# EAGLE design Adafruit Bluefruit LE nRF8001 v2 (EAGLE 6.4)
AUTHOR: K. Townsend
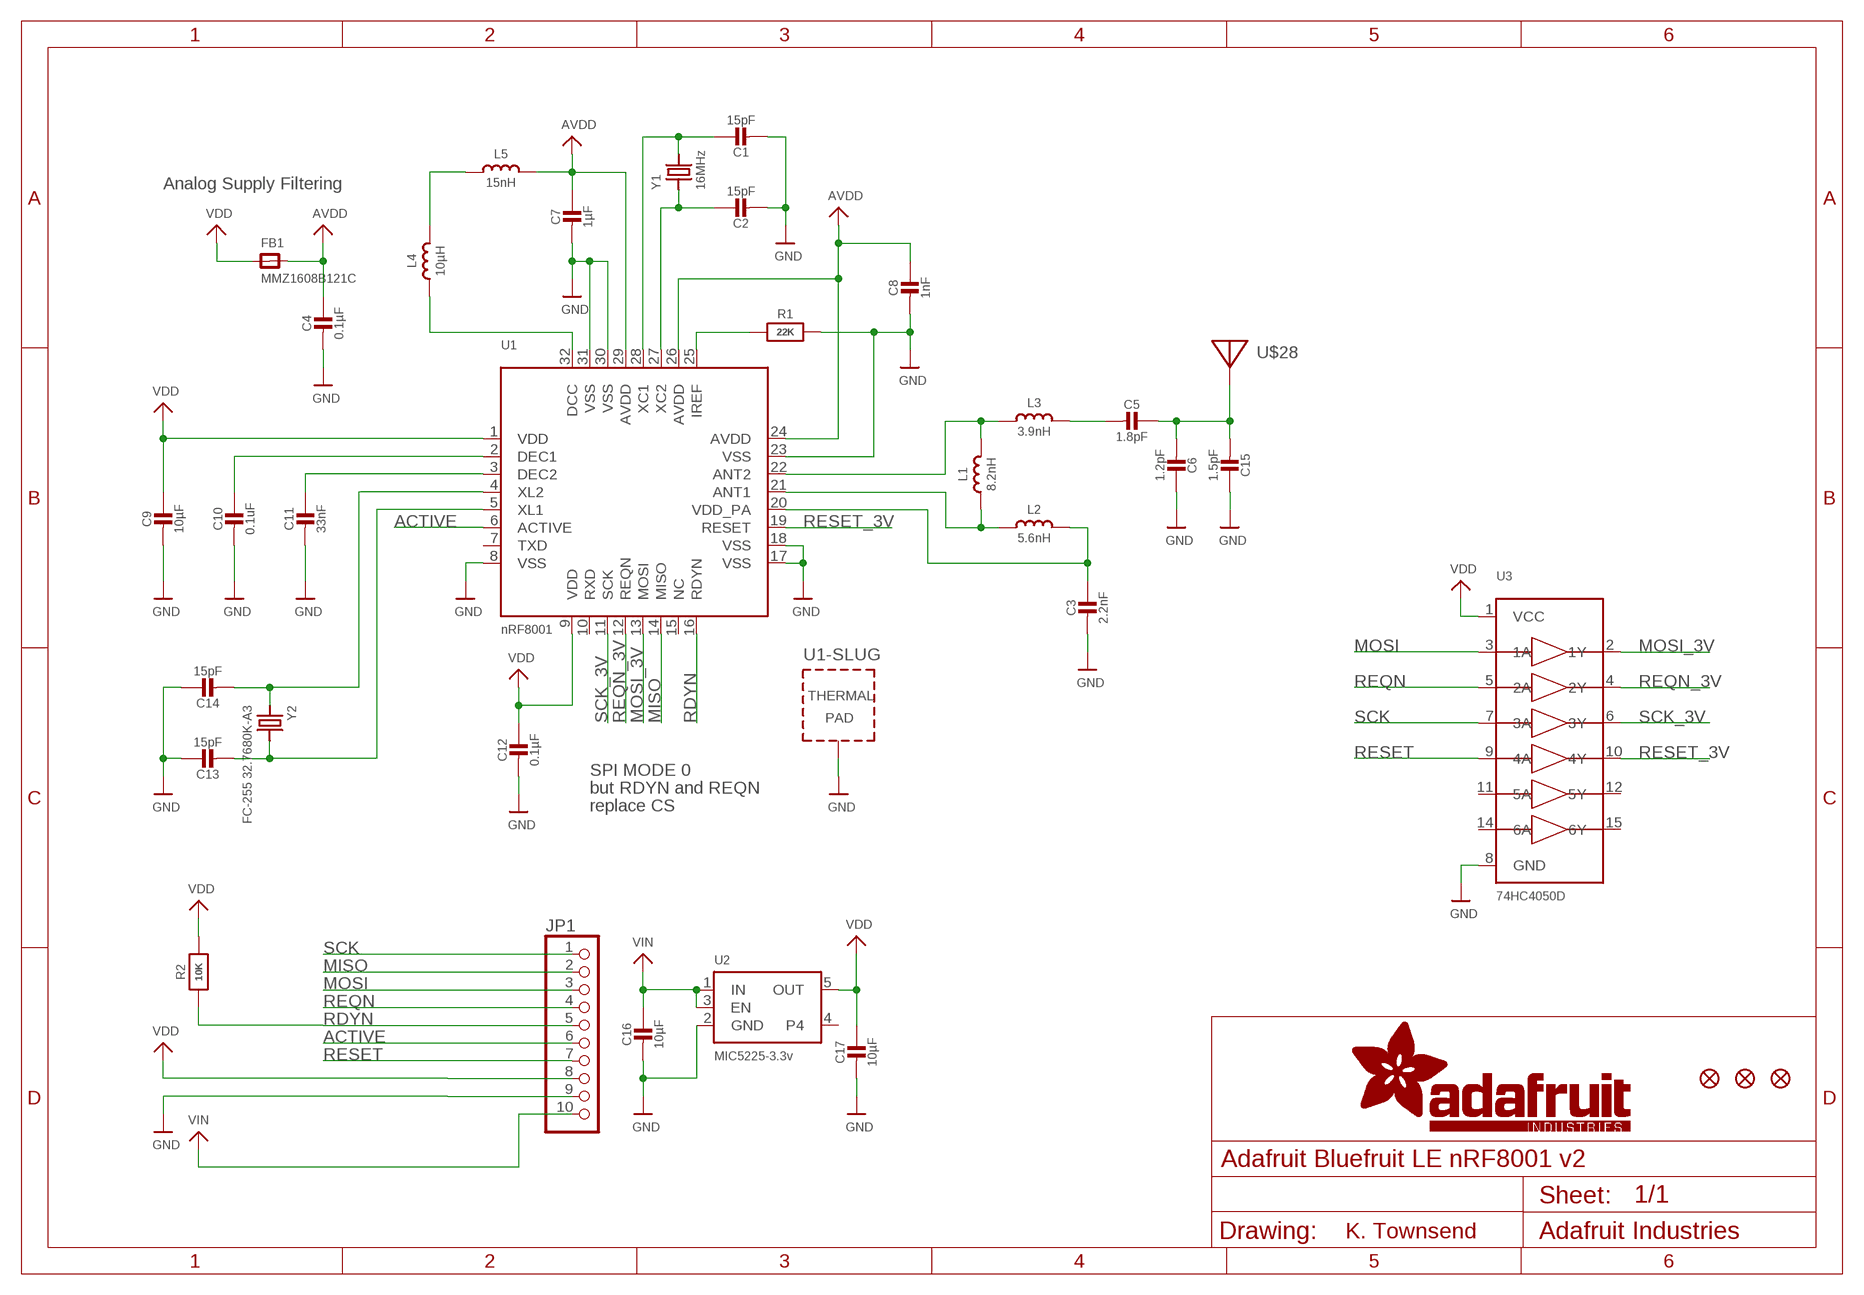
[diagram p0: schematic, sheet 1]

## Parts
C1  15pF  CAP_CERAMIC0805-NOOUTLINE  [0805-NO]
C2  15pF  CAP_CERAMIC0805-NOOUTLINE  [0805-NO]
C3  2.2nF  CAP_CERAMIC_0402  [_0402]
C4  0.1µF  CAP_CERAMIC0805-NOOUTLINE  [0805-NO]
C5  1.8pF  CAP_CERAMIC_0402MP  [_0402MP]
C6  1.2pF  CAP_CERAMIC_0402MP  [_0402MP]
C7  1µF  CAP_CERAMIC0805-NOOUTLINE  [0805-NO]
C8  1nF  CAP_CERAMIC_0603  [_0603]
C9  10µF  CAP_CERAMIC0805-NOOUTLINE  [0805-NO]
C10  0.1uF  CAP_CERAMIC0805-NOOUTLINE  [0805-NO]
C11  33nF  CAP_CERAMIC0805-NOOUTLINE  [0805-NO]
C12  0.1µF  CAP_CERAMIC0805-NOOUTLINE  [0805-NO]
C13  15pF  CAP_CERAMIC0805-NOOUTLINE  [0805-NO]
C14  15pF  CAP_CERAMIC0805-NOOUTLINE  [0805-NO]
C15  1.5pF  CAP_CERAMIC_0402MP  [_0402MP]
C16  10µF  CAP_CERAMIC0805-NOOUTLINE  [0805-NO]
C17  10µF  CAP_CERAMIC0805-NOOUTLINE  [0805-NO]
FB1  MMZ1608B121C  FERRITE0805  [0805]
FID1  FIDUCIAL""  [FIDUCIAL_1MM]
FID2  FIDUCIAL""  [FIDUCIAL_1MM]
FID3  FIDUCIAL""  [FIDUCIAL_1MM]
JP1  HEADER-1X1070MIL  [1X10_ROUND70]
L1  8.2nH  INDUCTOR_0402  [_0402]
L2  5.6nH  INDUCTOR_0402  [_0402]
L3  3.9nH  INDUCTOR_0402  [_0402]
L4  10µH  INDUCTOR_0603  [_0603]
L5  15nH  INDUCTOR_0603  [_0603]
R1  22K  RESISTOR_0805MP  [_0805MP]
R2  10K  RESISTOR0805_NOOUTLINE  [0805-NO]
U1  nRF8001  NRF8001  [QFN32_5MM]
U2  MIC5225-3.3v  VREG_SOT23-5  [SOT23-5]
U3  74HC4050D  74HC4050DTSSOP  [TSSOP16]
U$28  ANTENNA_PCBNRF8001_1.6MM  [ANT_PCB_2.4GHZ_NRF8001_1.6MM_1OZ]
Y1  16MHz  CRYSTAL3.2X2.5  [CRYSTAL_3.2X2.5]
Y2  FC-255 32.7680K-A3  CRYSTAL8.0X3.8  [CRYSTAL_8X3.8]

## Nets
+3.3V: C9.1 C12.1 C17.1 FB1.1 JP1.8 R2.2 U1.1(VDD) U1.9(VDD) U2.5(OUT) U3.1(VCC) ; supply symbol labelled VDD
ACTIVE: JP1.6 U1.6(ACTIVE)
AVDD: C4.1 C7.1 C8.1 FB1.2 L5.2 U1.24(AVDD) U1.26(AVDD) U1.29(AVDD)
GND: C1.2 C2.2 C3.2 C4.2 C6.1 C7.2 C8.2 C9.2 C10.2 C11.2 C12.2 C13.1 C14.1 C15.1 C16.2 C17.2 JP1.9 R1.2 U1.8(VSS) U1.17(VSS) U1.18(VSS) U1.23(VSS) U1.30(VSS) U1.31(VSS) U1.33(TP) U2.2(GND) U3.8(GND)
MISO: JP1.2 U1.14(MISO)
MOSI: JP1.3 U3.3(1A)
MOSI_3V: U1.13(MOSI) U3.2(1Y)
N$2: L1.2 L3.1 U1.22(ANT2)
N$3: L1.1 L2.1 U1.21(ANT1)
N$4: C3.1 L2.2 U1.20(VDD_PA)
N$5: L4.2 L5.1
N$6: C5.2 L3.2
N$7: C11.1 U1.3(DEC2)
N$8: C10.1 U1.2(DEC1)
N$9: C1.1 U1.28(XC1) Y1.2
N$10: C2.1 U1.27(XC2) Y1.1
N$11: L4.1 U1.32(DCC)
N$12: R1.1 U1.25(IREF)
N$13: C5.1 C6.2 C15.2 U$28.FEED
N$22: C14.2 U1.4(XL2) Y2.P$1
N$23: C13.2 U1.5(XL1) Y2.P$4
RDYN: JP1.5 R2.1 U1.16(RDYN)
REQN: JP1.4 U3.5(2A)
REQN_3V: U1.12(REQN) U3.4(2Y)
RESET: JP1.7 U3.9(4A)
RESET_3V: U1.19(RESET) U3.10(4Y)
SCK: JP1.1 U3.7(3A)
SCK_3V: U1.11(SCK) U3.6(3Y)
VIN: C16.1 JP1.10 U2.1(IN) U2.3(EN)
Unconnected: U1.7(TXD) U1.10(RXD) U1.15(NC) U2.4 U3.11(5A) U3.12(5Y) U3.14(6A) U3.15(6Y)

## Notes on the sheet
- Analog Supply Filtering
- SPI MODE 0
- but RDYN and REQN
- replace CS

## Library data of the parts
C1-C17 = microbuilder:CAP_CERAMIC: Ceramic Capacitors For new designs, use the packages preceded by an '_' character since they are more reliable: The following footprints should be used on most boards: _0402 - Standard footprint for regular board layouts _0603 - Standard footprint for regular board layouts _0805 - Standard footprint for regular board layouts _1206 - Standard footprint for regular board layouts For extremely tight-pitch boards where space is at a premium, the following 'micro-pitch' footprints can be used (smaller pads, no silkscreen outline, etc.): _0402MP - Micro-pitch footprint for very dense/compact boards _0603MP - Micro-pitch footprint for very dense/compact boards _0805MP - Micro-pitch footprint for very dense/compact boards _1206MP - Micro-pitch footprint for very dense/compact boards
FB1 = microbuilder:FERRITE: Ferrite Bead 0603 MMZ1608B121C - 120 Ohm @ 100MHz, 600mA, 0.15 Ohm DC Resistance - Digikey: 445-2164-1-ND BK1608HW121-T - 120 Ohm, 600mA Ferrite Chip - Digikey: 587-1876-2-ND 0805 HZ0805B272R-10 - 2.7K Ohm @ 100MHz, 200mA, 0.8 Ohm DC Resistance - Digikey: 240-2504-1-ND (see also Murata BLM21BD272SN1L) MMZ2012Y152B - 1.5K Ohm @ 100MHz, 500mA, 0.4 Ohm DC Resistance - Digikey: 445-1560-1-ND - Mainly for high frequency (80-400MHz) MMZ2012R102A - 1K Ohm @ 100MHz, 500mA, 0.3 Ohm DC Resistance - Digikey: 445-1555-2-ND - More general purpose (10-200MHz)
FID1-FID3 = microbuilder:FIDUCIAL: Fiducial Alignment Points Various fiducial points for machine vision alignment.; BOM: EXCLUDE
JP1 = microbuilder:HEADER-1X10: PIN HEADER
L1-L5 = microbuilder:INDUCTOR: Inductors 0603: 10nH Ceramic Inductor - microwire antenna/RF (Digikey: 712-1434-2-ND) 0805: 560nH Ceramic Inductor - RF (Digikey: 553-1047-1-ND) 270nH Ceramic Inductor - Q = 40@250MHz, +-5%, 1 Ohm DC Resistance (Digikey: 535-10506-2-ND) 1007 (2518 Metric) SMT: 10µH 10% 250mOhm 820mA 1007 Inductor (Digikey: 587-2189-1-ND) 22µH 10% 500mOhm 580mA 1007 Inductor (Digikey: 587-2190-1-ND) 47µH 10% 950mOhm 420mA 1007 Inductor (Digikey: 587-2191-1-ND) 47µH 5% 100mOhm 1A 1008 Inductor (Digikey: 732-1816-1-ND) 5.0x5.0mm (Taiyo Yuden NR5040 Series) 6.8µH 20% 2.3A 64mOhm Inductor (Digikey: 587-2374-2-ND) 5.0x5.0mm (TDK VLC5045 Series) 4.7µH 20% 3.3A 34mOhm Inductor (Digikey: 445-6526-1-ND) 6.8µH 20% 2.7A 46mOhm Inductor (Digikey: 445-6527-1-ND) 6.0x6.0mm (TDK VLC6045 Series) 4.7µH 20% 3.8A 27mOhm Inductor (Digikey: 445-6538-2-ND) 6.8µH 20% 3A 41mOhm Inductor (Digikey: 445-6540-1-ND) 6.2µH 30% 2.2A 45mOhm Inductor (Digikey: SRR5028-6R2YCT-ND) - Not TDK VLC6045 but footprint should match 6.0x6.0mm (TDK SLF6045 Series) 6.8uH 30% 2A 33mOhm Inductor (Digikey: 445-4572-1-ND, Mouser: 810-SLF645T6R8N2R0PF) 6.0x6.0mm (Sumida CDRH5D28 Series) 6.2uH 30% 1.8A 45mOhm Inductor (Digikey: 308-1542-1-ND) Taiyo Yuden NR3015T2R2M - 2.2uH 20% 1.5A (Digikey: 587-1648-2-ND, Mouser: 963-NR3015T2R2M) - Used with TI TPS62172 CoilCraft RFID Transponder Coil - MA5532-AE (For use with AS3935 Lightning Sensor)
R1 R2 = microbuilder:RESISTOR: Resistors For new designs, use the packages preceded by an '_' character since they are more reliable: The following footprints should be used on most boards: _0402 - Standard footprint for regular board layouts _0603 - Standard footprint for regular board layouts _0805 - Standard footprint for regular board layouts _1206 - Standard footprint for regular board layouts For extremely tight-pitch boards where space is at a premium, the following 'micro-pitch' footprints can be used (smaller pads, no silkscreen outline, etc.): _0402MP - Micro-pitch footprint for very dense/compact boards _0603MP - Micro-pitch footprint for very dense/compact boards _0805MP - Micro-pitch footprint for very dense/compact boards _1206MP - Micro-pitch footprint for very dense/compact boards
U1 = microbuilder:NRF8001: nRF8001 - Bluetooth Low-Energy Transceiver VDD: 1.9-3.6V Temp: -40°C - 85°C
U2 = microbuilder:VREG_SOT23-5: SOT23-5 Fixed Voltage Regulators Part Current Out V Out V In V Dropout θJA (°C/W) TJ (°C) Digikey Part No. ADP121 150mA 3.3V 3.4-5.5V 0.09V @ 150mA -- -- ADP121-AUJZ33R7CT-ND ADP121 150mA 3.0V 3.1-5.5V 0.09V @ 150mA -- -- ADP121-AUJZ30R7CT-ND ADP122 300mA 3.3V 3.4-5.5V 0.085V @ 300mA -- -- ADP122AUJZ-3.3-R7CT-ND ADP1712 300mA 3.3V 3.5-5.5V 0.17V @ 300mA -- -- ADP1712AUJZ-3.3-R7TR-ND AP7311 (Low Cost) 150mA 3.3V 3.5-6V 0.15V @ 150mA -- -- AP7311-33WG-7DICT-ND LD39015M18R 150mA 1.8V 1.9V-5.5V 0.08V @ 100mA -- -- 497-6977-1-ND LP2985A-33DBVR 150mA 3.3V 3.3-16V 0.28V @ 150mA 206 150 296-18479-1-ND MCP1824T-3302E/OT 300mA 3.3V 3.5V-6V 0.2V @ 300mA -- -- MCP1824T-3302E/OTCT-ND MIC5205-2.5YM5 TR 150mA 2.5V 2.7-16V 0.165V @ 150mA -- -- 576-1257-2-ND MIC5205-3.0YM5 TR 150mA 3.0V 3.2V-16V 0.165V @ 150mA -- -- 576-1258-2-ND MIC5205-3.3YM5 TR 150mA 3.3V 3.5V-16V 0.165V @ 150mA -- -- 576-1259-2-ND TPS780330220 150mA 3.3V+2.2V 3.6-5.5V 250mV Max -- -- 296-23332-1-ND TDA3663/N1,135 100mA 3.3V 3.5-45V 0.18V @ 50mA -- -- 568-5343-1-ND Max operating temp can be calculated using θJA, TJ (max junction temperature), and power in watts. Set the "Maximum Ambient Temperature" until it reaches TJ ("Max Junction Temperature"), which is the absolute limit for safe use of the regulator: Heat Sink Temperature Calculator <http://www.daycounter.com/Calculators/Heat-Sink-Temperature-Calculator.phtml> For example, With 12V source into a 3.3V LP2985 and a 30mA load, we are dissipating (12V-3.3V) * 0.03A = 0.261W. With a θJA of 206 °C/W, a TJ of 150°C, and 261mW we can safely use the chip without a heat sink up to 75°C (=147.1°C Junction Temperature).
U3 = microbuilder:74HC4050D: 6-channel level shifter 74HC4050D - 2V-6V Supply SOIC16 Digikey: 74HC4050D,653-ND Mouser: 771-74HC4050D-T TSSOP16 Digikey: 296-9215-1-ND Mouser:
U$28 = microbuilder:ANTENNA_PCB: Various pre-calculated PCB Antennas NRF8001 1.6mm 1Oz - 2.4GHz PCB antenna for 1.6mm PCBs with 1oz copper, double-sided boards (no GND plan beneath antenna). See nRF2740 production files for further information and impedance matching network. 868MHz/2.4GHz DUALBAND - Dual 868MHz and 2.4GHz centered antenna based on board #6 of the CC-ANTENNA-DK from Chipcon/TI
Y1 Y2 = microbuilder:CRYSTAL: Crystals HC49UP - Surface Mount Crystal 4.0MHz 18pF +/-30ppm Surface Mount Crystal [Digikey: 535-9857-1-ND] 12.0 MHz Surface Mount Crystal [Digikey: 535-9869-6-ND] 25.0 MHz Surface Mount Crystal [Digikey: 535-9078-1-ND] 2.5 x 2.0mm - MEMs SMT Crystal 16.0 MHz 10pF 20ppm 2.5 x 2.0mm Crystal [Digikey -40-85°C: 535-10923-1-ND] 3.2 x 2.5mm - MEMs SMT Crystal 12.0 MHz 8pF 15ppm 3.2 x 2.5mm Crystal [Digikey: -10-70°C: 644-1047-1-ND -40-125°C: 644-1128-1-ND] 40~85°C cheaper: 644-1173-6-ND 16.0 MHz 8pF 15ppm 3.2 x 2.5mm Crystal [Digikey: -10-70°C: 644-1049-1-ND -40-125°C: 644-1129-2-ND]-40~85°C cheaper: 644-1175-6-ND 16.0 MHz 10pF 10ppm 3.2 x 2.5mm Crystal [Digikey: 644-1100-1-ND] 27.12 MHz 18pF 30ppm 3.2 x 2.5mm Crystal [Digikey: 887-1424-1-ND] 27.12MHz 10pF 10ppm 3.2 x 2.5mm Crystal [Digikey: 887-1329-1-ND] 4.9 x 1.8mm - MEMs SMT Crystal 32.768 KHz 12.5pF 20ppm 4.9 x 1.8mm Crystal [Digikey: SE2415CT-ND] 8.0 x 3.8mm - Surface Mount Crystal 32.768kHz 12.5pF 20ppm -40°C-85°C [Digikey: 535-9166-2-ND] Cylinder 32.768KHz Cylinder Crystal (2x6mm body) [Ex. Digikey: 300-8341-2-ND]

## Board
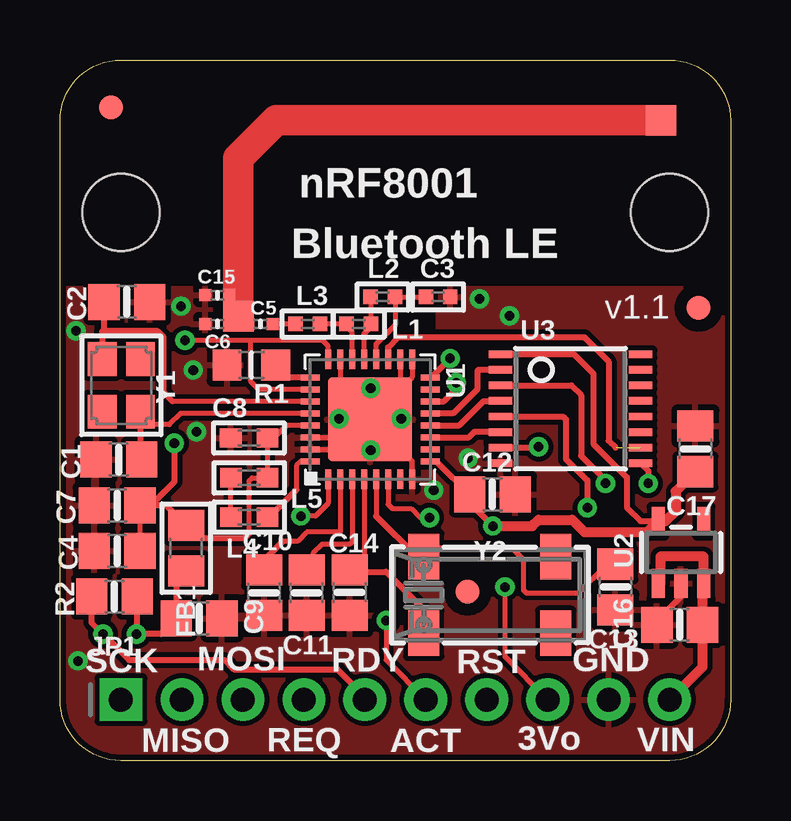
[diagram p1: board, top side]
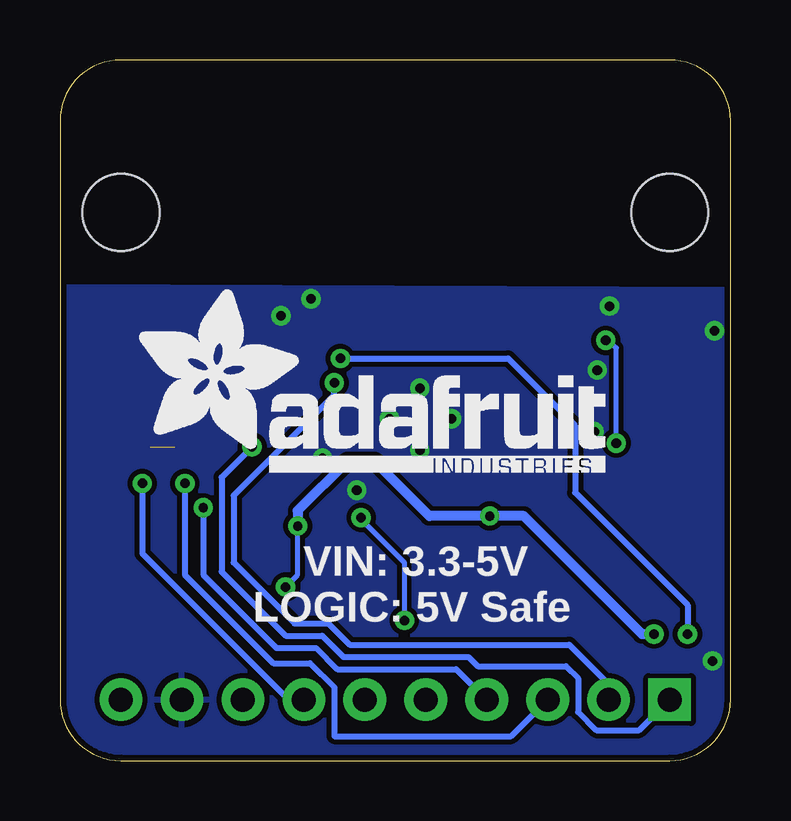
[diagram p2: board, bottom side, seen from below]

Size 27.94 x 29.21 mm. Coordinates in mm from the lower left corner, seen from the top.
Outline: 2.54,29.21 25.4,29.21 arc-90 27.94,26.67 27.94,2.54 arc-90 25.4,0 2.54,0 arc-90 0,2.54 0,26.67 arc-90 2.54,29.21
Copper layers (1*16): Top 0.035mm / dielectric 1.5mm / Bottom 0.035mm
Design rules "adafruit": minimum track width 8mil, minimum drill 15.5mil, track to track 8mil, track to pad 8mil, pad to pad 8mil, via to via 8mil, smd to smd 8mil, copper to edge 10mil, drill to drill 8mil, minimum pad ring 10mil, minimum via ring 8mil, stop-mask expansion 2mil, vias tented up to drill 20mil, thermal gap 10mil
Holes 3.2 mm at 2.54,22.86 25.4,22.86
tRestrict: area 10.3,13.2 to 10.6,13.3

### Footprints (pad centres in the part's own frame; a part is rotated, then mirrored left to right if it is on the bottom)
0805-NO = smd 1.3 x 1.5: 1 -0.95,0; 2 0.95,0
_0402 = smd 0.6 x 0.6: 1 -0.508,0; 2 0.508,0
_0402MP = smd 0.5 x 0.5: 1 -0.508,0; 2 0.508,0
_0603 = smd 0.9 x 0.8: 1 -0.762,0; 2 0.762,0
0805 = smd 1.3 x 1.5: 1 -0.95,0; 2 0.95,0
FIDUCIAL_1MM = smd 1 x 1: 1 0,0
1X10_ROUND70 = drill 1 pad 1.778 square: 1 -11.43,0 | drill 1 pad 1.778: 2 -8.89,0; 3 -6.35,0; 4 -3.81,0; 5 -1.27,0; 6 1.27,0; 7 3.81,0; 8 6.35,0; 9 8.89,0; 10 11.43,0
_0805MP = smd 1.2 x 1.3: 1 -1.016,0; 2 1.016,0
QFN32_5MM = smd 0.8 x 0.25: 1 -2.5,1.75; 2 -2.5,1.25; 3 -2.5,0.75; 4 -2.5,0.25; 5 -2.5,-0.25; 6 -2.5,-0.75; 7 -2.5,-1.25; 8 -2.5,-1.75; 17 2.5,-1.75; 18 2.5,-1.25; 19 2.5,-0.75; 20 2.5,-0.25; 21 2.5,0.25; 22 2.5,0.75; 23 2.5,1.25; 24 2.5,1.75 | smd 0.25 x 0.8: 9 -1.75,-2.5; 10 -1.25,-2.5; 11 -0.75,-2.5; 12 -0.25,-2.5; 13 0.25,-2.5; 14 0.75,-2.5; 15 1.25,-2.5; 16 1.75,-2.5; 25 1.75,2.5; 26 1.25,2.5; 27 0.75,2.5; 28 0.25,2.5; 29 -0.25,2.5; 30 -0.75,2.5; 31 -1.25,2.5; 32 -1.75,2.5 | smd 3.5 x 3.5: 33 0,0
SOT23-5 = smd 0.55 x 1.2: 1 -0.95,-1.3; 2 0,-1.3; 3 0.95,-1.3; 4 0.95,1.3; 5 -0.95,1.3
TSSOP16 = smd 0.305 x 0.991: 1 -2.275,-2.918; 2 -1.625,-2.918; 3 -0.975,-2.918; 4 -0.325,-2.918; 5 0.325,-2.918; 6 0.975,-2.918; 7 1.625,-2.918; 8 2.275,-2.918; 9 2.275,2.918; 10 1.625,2.918; 11 0.975,2.918; 12 0.325,2.918; 13 -0.325,2.918; 14 -0.975,2.918; 15 -1.625,2.918; 16 -2.275,2.918
ANT_PCB_2.4GHZ_NRF8001_1.6MM_1OZ = smd 1.27 x 1.27: FEED 0,0; TESTPOINT -8.169,17.605
CRYSTAL_3.2X2.5 = smd 1.4 x 1.2: 1 -1.1,-0.8; 2 1.1,0.8; GND1 -1.1,0.8; GND2 1.1,-0.8
CRYSTAL_8X3.8 = smd 1.3 x 1.9: P$1 -2.75,-1.6; P$2 2.75,-1.6; P$3 2.75,1.6; P$4 -2.75,1.6

### Placement (x,y rotation side)
C1  2.45,12.55 180 top
C2  2.78,19.12 0 top
C3  15.75,19.33 0 top
C4  2.38,8.74 180 top
C5  8.35,18.2 0 top
C6  6.55,18.2 0 top
C7  2.38,10.64 180 top
C8  7.88,13.45 180 top
C9  5.8,5.93 0 top
C10  8.5,7 270 top
C11  10.27,7 270 top
C12  18.02,11.1 0 top
C13  23.14,7.24 90 top
C14  12.07,7 90 top
C15  6.55,19.4 0 top
C16  25.82,5.66 180 top
C17  26.48,13 90 top
FB1  5.25,8.86 90 top
FID1  16.98,7.04 270 top
FID2  26.61,18.88 270 top
FID3  2.13,27.24 270 top
JP1  13.97,2.54 0 top
L1  12.45,18.2 180 top
L2  13.45,19.33 0 top
L3  10.33,18.2 180 top
L4  7.89,10.15 180 top
L5  7.89,11.79 0 top
R1  7.98,16.49 180 top
R2  2.27,6.84 0 top
U1  12.92,14.23 90 top
U2  25.87,8.68 0 top
U3  21.27,14.67 270 top
U$22  [ADAFRUIT_TEXT_20MM]  24.8,12.01 0 bottom
U$28  7.43,18.52 270 top
Y1  2.55,15.64 270 top
Y2  17.9,6.91 0 top

### Tracks (layer width: path | path; a pad name or v marks a point on that pad's centre or on a via)
+3.3V  (via drill 0.39, 0.4)
  Top 0.203: U1.9 15.71,12.48 | U1.1 11.17,10.72 10.65,10.2 v10.03,10.2 | JP1.8 18.54,4.32 v18.54,7.24
  Top 0.254: U3.1 21.41,16.95 22.23,16.13 22.23,13.21 23.62,11.81 23.62,10.54 24.18,9.98 U2.5 | 15.71,12.48 15.71,12.46 C12.1 17.07,10.74 v18.03,9.78 | FB1.1 4.85,7.51 C9.1 4.2,5.28 v3.19,5.28 3.19,6.81 R2.2
  Top 0.406: C17.1 25.65,11.22 25.65,10.41 25.22,9.98 U2.5 24.46,9.53 21.84,9.53 21.34,10.03 19.94,10.03 19.68,9.78 v18.03,9.78
  Bottom 0.203: v18.54,7.24 18.03,7.75 v18.03,9.78
  Bottom 0.406: v3.19,5.28 3.7,5.28 8.62,10.2 v10.03,10.2 12.55,10.2 14.83,12.48 15.98,12.48 18.03,10.42 v18.03,9.78
ACTIVE  (via drill 0.39, 0.4)
  Top 0.203: U1.6 13.67,10.68 13.85,10.5 14.63,10.5 15,10.13 v15.39,10.13 | v13.59,5.84 13.59,4.19 JP1.6
  Bottom 0.203: v15.39,10.13 15.46,10.13 13.59,8.25 v13.59,5.84
AVDD  (via drill 0.4)
  Top 0.203: U1.24 11.17,17.28 10.95,17.5 7.95,17.5 | 7.95,17.5 5.22,17.5 v5.2,17.52 | U1.26 8.28,15.48 7.95,15.8 7.95,17.5 | U1.29 9.42,13.98 | C7.1 C4.1 | C8.1 L5.2 8,11.79 7.88,11.67 7.88,9.47
  Top 0.254: 9.42,13.98 8.89,13.45 C8.1 | v4.76,13.24 4.76,11.62 3.78,10.63 C7.1 4.42,10.63 FB1.2 5.25,9.61 5.59,9.27 7.69,9.27 7.88,9.47
  Bottom 0.203: v4.76,13.24 4.76,17.2 5.06,17.5 5.19,17.5 v5.2,17.52
GND  (via drill 0.4)
  Top 0.203: U1.33 12.17,13.48 11.55,13.48 | U1.8 14.67,12.48 U1.33 | U1.17 14.67,15.98 U1.33 | U1.23 11.67,15.78 11.75,15.7 12.77,15.7 v12.95,15.52 | U1.18 14.17,14.3 v14.22,14.25 | U1.30 11.55,13.48 | U1.31 11.48,12.98 11.55,12.9 11.55,13.48
  Top 0.254: U2.2 25.87,6.82 24.87,5.82 C16.2
  other vias: 12.95,12.93 11.63,14.25 15.57,11.27 18.74,18.54 17.48,19.26 5.68,13.71 5.55,16.28 17.01,12.61 0.75,4.16 0.66,17.91 5.05,18.95
  pour Bottom: 0,19.64 28.02,19.77 28.02,-0.03 0,-0.15
  pour Top: 15.75,15.7 15.75,19.7 27.89,19.7 27.89,-0.03 0,-0.03 0,19.7 6.25,19.7 6.25,17.2 10.25,17.2 10.25,15.7
MISO  (via drill 0.39)
  Top 0.254: U1.14 15.99,14.98 16.51,15.49 v16.51,15.75
  Bottom 0.254: JP1.2 5.08,3.17 6.73,4.83 15.88,4.83 16.76,5.71 18.16,5.71 20.7,8.26 20.7,11.05 16.51,15.24 v16.51,15.75
MOSI  (via drill 0.39)
  Top 0.254: U3.3 21.31,15.64 21.72,15.24 21.72,12.7 22.73,11.68 v22.73,11.56
  Bottom 0.254: v22.73,11.56 22.73,7.75 19.05,4.06 17.53,4.06 16.51,3.05 16.51,1.02 9.14,1.02 JP1.3
MOSI_3V
  Top 0.254: U3.2 17.44,16.3 17.4,16.26 17.4,15.49 16.38,14.48 U1.13
N$2
  Top 0.203: U1.22 12.17,17.88 11.95,18.1 L1.2 L3.1
N$3
  Top 0.203: U1.21 12.67,17.81 12.96,18.1 L1.1 12.96,19.31 L2.1
N$4
  Top 0.203: U1.20 13.17,17.37 13.96,18.16 L2.2 C3.1
N$5
  Top 0.203: L4.2 L5.1
N$6
  Top 0.203: L3.2 C5.2
N$7
  Top 0.203: U1.3 12.17,9.12 12.06,9.02 10.92,9.02 10.54,8.64 10.54,8.22 C11.1
N$8
  Top 0.203: U1.2 11.67,9.53 10.29,9.53 9.91,9.14 9.27,9.14 | 8.5,8.12 C10.1
  Top 0.254: 9.27,9.14 8.5,8.38 C10.1
N$9
  Top 0.203: U1.28 5.03,14.48 4.55,14 3.9,14
  Top 0.254: 3.9,14 3.36,14.54 Y1.2 3.35,12.6 C1.1
N$10
  Top 0.203: U1.27 4.68,14.98
  Top 0.254: 4.68,14.98 4.32,15.34 4.32,17.65 4.06,17.91 1.78,17.91 | 1.78,17.91 1.75,17.88 Y1.1 | 1.78,17.91 1.83,17.96 C2.1
N$11
  Top 0.203: U1.32 10.03,12.48 9.85,12.3 9.85,11.29
  Top 0.254: 9.85,11.29 8.71,10.15 L4.1
N$12
  Top 0.254: U1.25 9.51,15.98 R1.1
N$13
  Top 0.203: C5.1 C6.2 7.06,18.15 U$28.FEED 7.06,18.89 C15.2
N$22
  Top 0.203: U1.4 12.67,8.56 C14.2
  Top 0.254: C14.2 12.51,7.95 12.59,7.87 13.59,7.87 15.15,6.31 Y2.P$1
N$23
  Top 0.203: U1.5 13.17,10.18 | Y2.P$4 15.54,8.89 18.8,8.89 19.3,8.38 19.3,7.11 19.43,6.99 21.59,6.99 22.79,8.19 C13.2
  Top 0.254: 13.17,10.18 13.19,10.18 14.86,8.51 Y2.P$4
RDYN  (via drill 0.39, 0.4)
  Top 0.254: U1.16 15.47,15.98 v16.26,16.76 | JP1.5 12.7,2.67 11.56,3.81 7.24,3.81 6.86,4.19 2.88,4.19 v1.79,5.28 1.32,5.75 R2.1
  Bottom 0.254: v16.26,16.76 9.27,16.76 6.48,13.97 6.48,11.18 1.79,6.49 v1.79,5.28
REQN  (via drill 0.39)
  Top 0.254: U3.5 20.96,14.35 21.08,14.22 21.08,12.57 21.97,11.68 v21.97,10.54
  Bottom 0.254: v21.97,10.54 21.97,7.75 18.92,4.7 17.27,4.7 16.38,3.81 11.43,3.81 JP1.4
REQN_3V
  Top 0.254: U1.12 16.64,13.98 17.65,14.99 18.34,14.99 U3.4
RESET  (via drill 0.39)
  Top 0.254: U3.9 24.51,12.07 v24.51,11.56
  Bottom 0.254: v24.51,11.56 24.51,8.64 18.41,2.54 JP1.7
RESET_3V  (1 unrouted)
  Top 0.254: U1.19 13.67,17.23 14.1,17.65 21.84,17.65 22.86,16.64 22.86,13.34 23.15,13.04
SCK  (via drill 0.39)
  Top 0.254: U3.7 19.98,13.04 v19.94,13.08
  Bottom 0.254: v19.94,13.08 21.21,11.81 21.21,7.87 18.54,5.21 17.02,5.21 16.13,4.32 10.92,4.32 10.54,3.94 6.86,3.94 6.35,3.43 6.35,2.03 5.59,1.27 3.81,1.27 JP1.1
SCK_3V
  Top 0.254: U1.11 17.03,13.48 17.27,13.72 17.95,13.72 17.97,13.7 U3.6
VIN
  Top 0.406: JP1.10 26.77,3.91 C16.1 26.77,7.38 U2.3 26.82,8.51 25.02,8.51 25.02,7.38 U2.1

### Text on the board
tPlace: nRF8001 | Bluetooth LE | v1.1 | SCK | MOSI | RDY | RST | GND | MISO | REQ | ACT | 3Vo | VIN
bPlace: VIN: 3.3-5V | LOGIC: 5V Safe